# EasyEDA Pro project BLE1.eprj

# Schematic Schematic1
Board Name: Board1; Create Date: 2025-10-13; Page Name: P1; Project Name: BLE1; Schematic Name: Schematic1; Update Date: 2025-10-13; Company: 嘉立创EDA; Page Size: A4; Version: V1.0
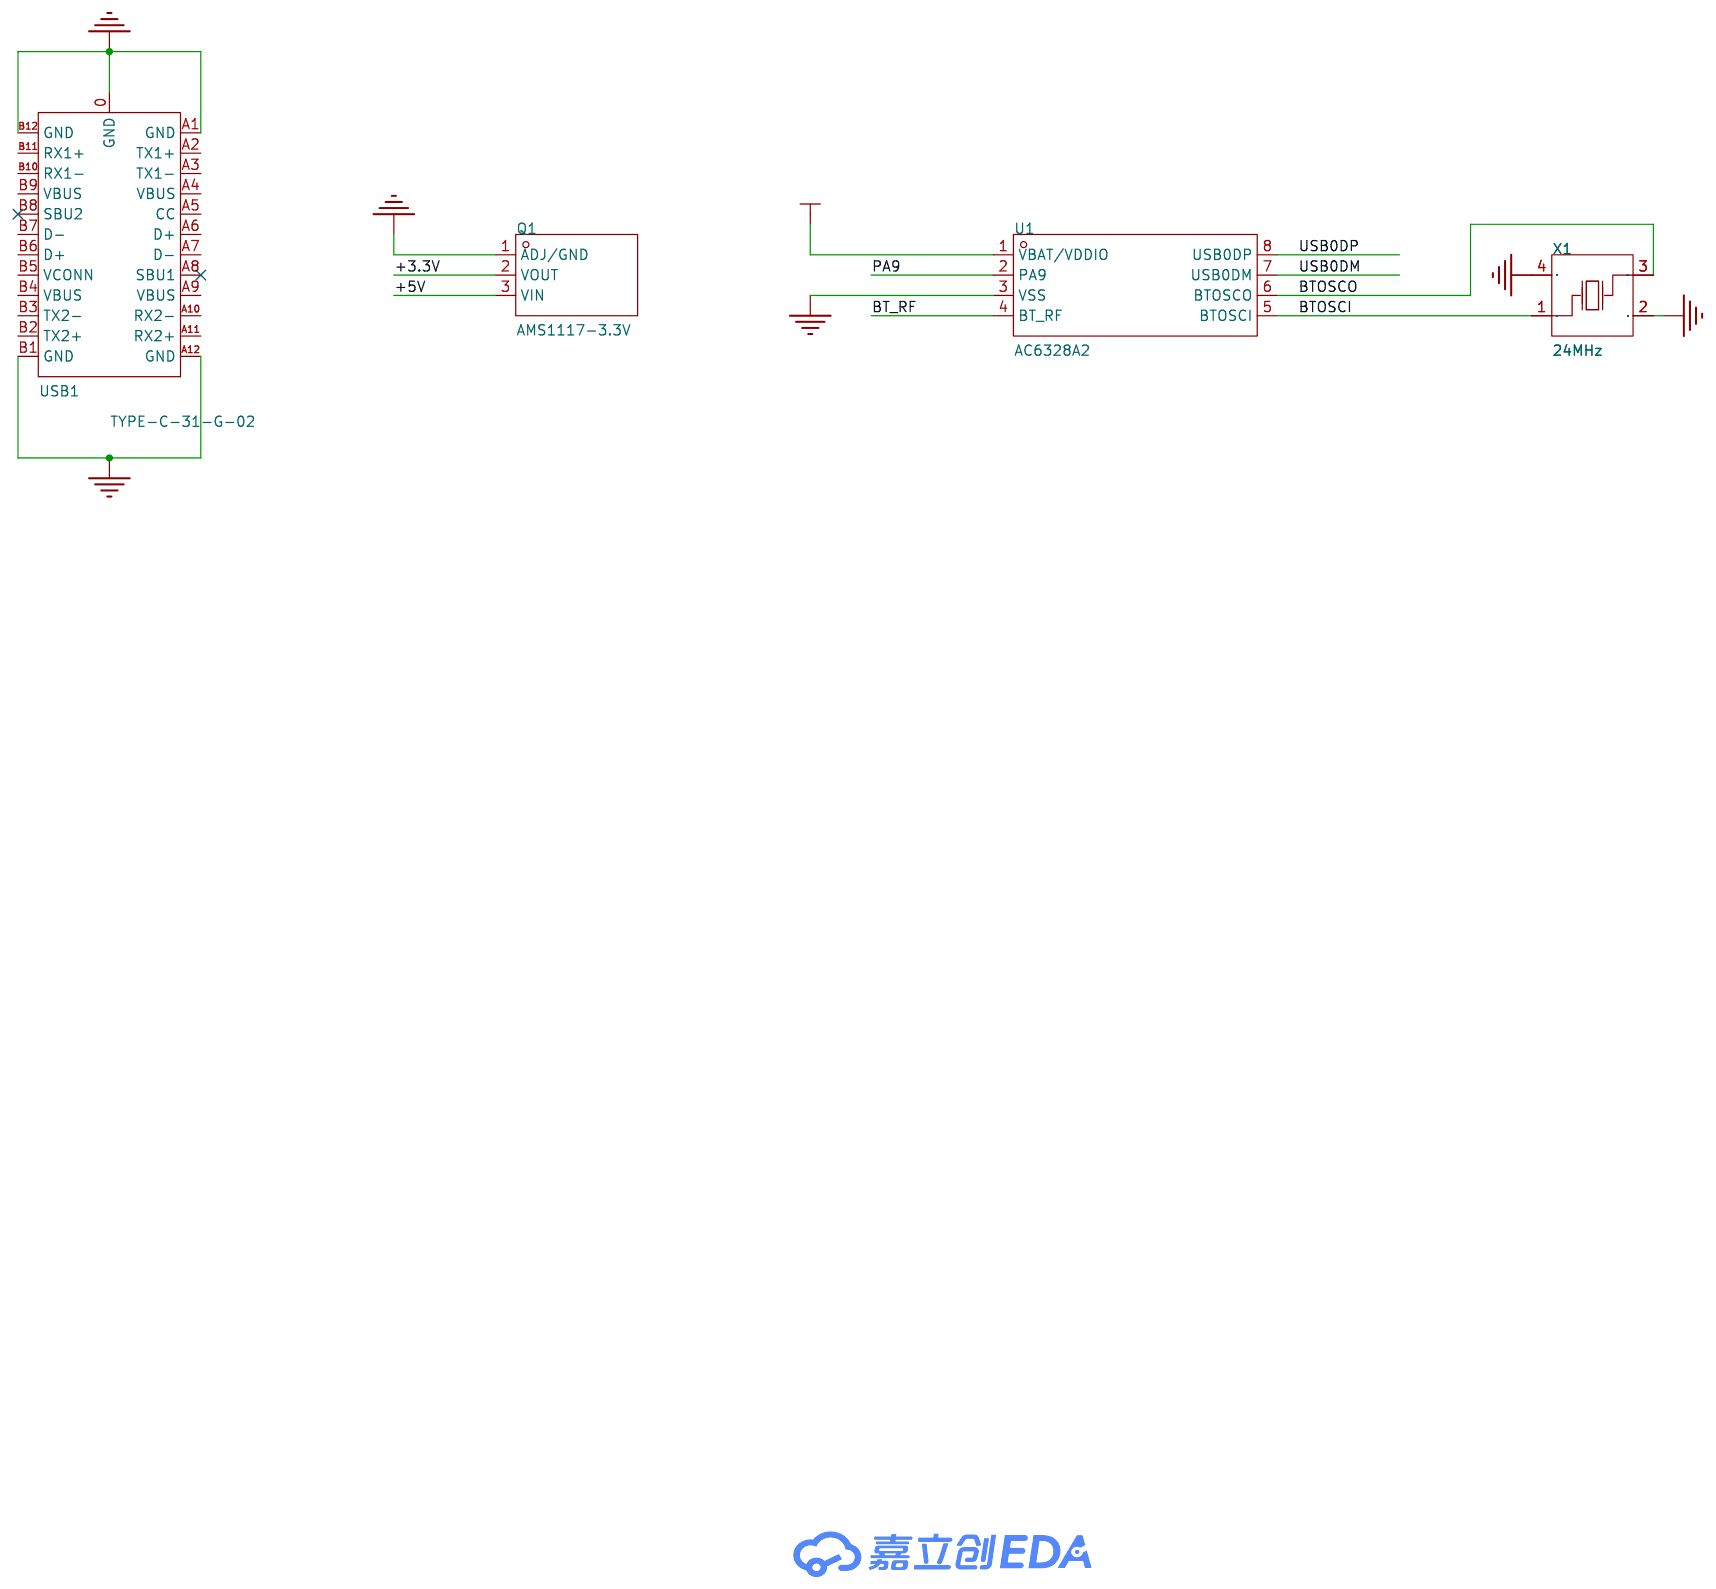
[diagram p0: schematic sheet]

## Parts
Q1  AMS1117-3.3V  [SOT-89-3_L4.5-W2.5-P1.50-LS4.2-BR]
U1  AC6328A2  [SOP-8_L4.9-W3.9-P1.27-LS6.0-BL]
USB1  TYPE-C-31-G-02  [USB-C-SMD_TYPE-C-31-G-02]
X1  24MHz  [CRYSTAL-SMD_4P-L3.2-W2.5-BL]

## Library data of the parts
Q1 = AMS1117-3.3V_C5120796: LCSC Part Name: 输入18V 输出3.3V 1A; Supplier Part: C5120796; Manufacturer: MSKSEMI(美森科); Supplier Footprint: SOT-89; JLCPCB Part Class: 扩展库; Datasheet: https://item.szlcsc.com/datasheet/AMS1117-3.3V/5706251.html; Supplier: LCSC; Output Type: 固定; Voltage - Supply: 18V; Output Voltage: 3.3V; Output Current: 1A; Voltage Dropout: 1.4V@(1A); standby current: 12mA; Operating Temperature: 0℃~+125℃; Output Configuration: 正极; Number of Outputs: 1
U1 = AC6328A2: Supplier Part: C5440080; Manufacturer: JL(杰理); Supplier Footprint: SOP-8; JLCPCB Part Class: 扩展库; Datasheet: https://atta.szlcsc.com/upload/public/pdf/source/20230327/498F5A24E1A7D4AE60F3EC0FBC1B9888.pdf; Supplier: LCSC
USB1 = TYPE-C-31-G-02: 连接器类型:Type-C;协议标准:-;公母:公;安装方式:夹板;触点数量:24P;端口数量:1;额定电流 - 电源:-;工作温度:-55℃~+85℃;; LCSC Part Name: Type-C 公 夹板; Supplier Part: C530606; Manufacturer: 韩国韩荣; Supplier Footprint: SMD; JLCPCB Part Class: 扩展库; Datasheet: https://item.szlcsc.com/datasheet/TYPE-C-31-G-02/550940.html; Supplier: LCSC; Connector Type: Type-C; Gender: 公; Mounting Type: 夹板; Number of Contacts: 24P; Number of Ports: 1; Operating Temperature: -55℃~+85℃
X1 = X322524MOB4SI: LCSC Part Name: YSX321SL 24MHZ 4P 3225 12PF ±10PPM -40~85℃ (±20PPM); Supplier Part: C70590; Manufacturer: YXC(扬兴晶振); Supplier Footprint: SMD3225-4P; JLCPCB Part Class: 扩展库; Datasheet: https://item.szlcsc.com/datasheet/X322524MOB4SI/71688.html; Supplier: LCSC; Type: 贴片晶振; Normal temperature Frequency Tolerance: ±10ppm; Load Capacitance: 12pF; Frequency Stability: ±20ppm; Operating Temperature: -40℃~+85℃

## Nets
+3.3V: Q1.2(VOUT) U1.1(VBAT/VDDIO)
+5V: Q1.3(VIN)
GND: Q1.1(ADJ/GND) U1.3(VSS) USB1.0(GND) USB1.A1(GND) USB1.A12(GND) USB1.B1(GND) USB1.B12(GND) X1.2(GND) X1.4(GND)
BT_RF: U1.4(BT_RF)
BTOSCI: U1.5(BTOSCI) X1.1(OSC1)
BTOSCO: U1.6(BTOSCO) X1.3(OSC2)
PA9: U1.2(PA9)
USB0DM: U1.7(USB0DM)
USB0DP: U1.8(USB0DP)

Not connected (* = marked no-connect by the designer): USB1 A2(TX1+) A3(TX1-) A4(VBUS) A5(CC) A6(D+) A7(D-) A8(SBU1)* A9(VBUS) A10(RX2-) A11(RX2+) B2(TX2+) B3(TX2-) B4(VBUS) B5(VCONN) B6(D+) B7(D-) B8(SBU2)* B9(VBUS) B10(RX1-) B11(RX1+)
